# Altium schematic sheet STM32G4.SchDoc
size B; SheetNumber: 2; SheetTotal: 4
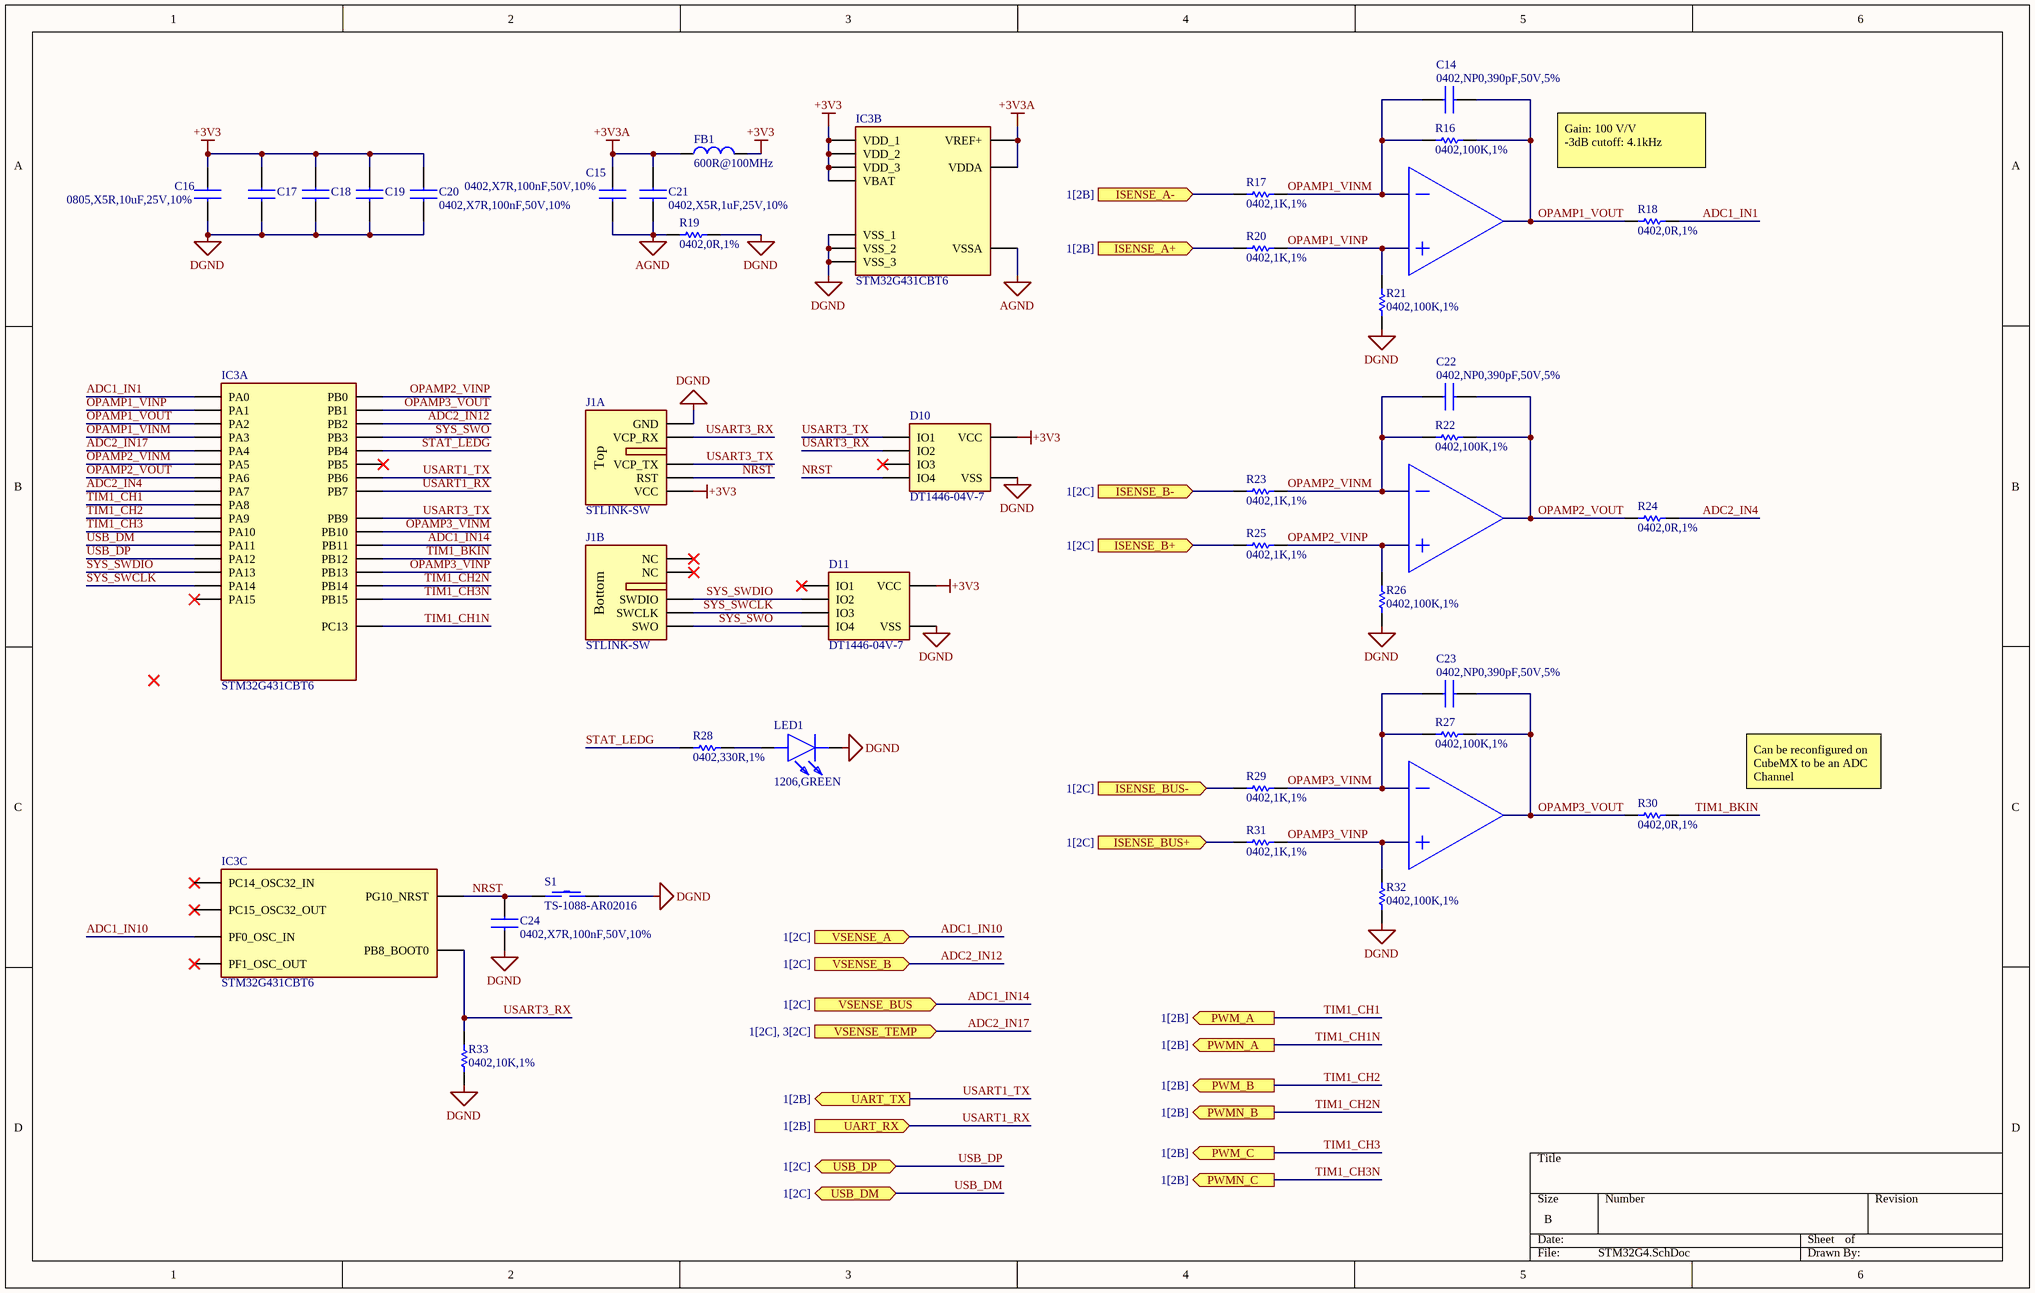
[diagram p0: STM32G4.SchDoc]

## Parts
C14  0402,NP0,390pF,50V,5%  [CAPC1005X55N]
C15  0402,X7R,100nF,50V,10%  [CAPC1005X55N]
C16  0805,X5R,10uF,25V,10%  [CAPC2012X145N]
C17  0402,X7R,100nF,50V,10%  [CAPC1005X55N]  (value not drawn)
C18  0402,X7R,100nF,50V,10%  [CAPC1005X55N]  (value not drawn)
C19  0402,X7R,100nF,50V,10%  [CAPC1005X55N]  (value not drawn)
C20  0402,X7R,100nF,50V,10%  [CAPC1005X55N]
C21  0402,X5R,1uF,25V,10%  [CAPC1005X55N]
C22  0402,NP0,390pF,50V,5%  [CAPC1005X55N]
C23  0402,NP0,390pF,50V,5%  [CAPC1005X55N]
C24  0402,X7R,100nF,50V,10%  [CAPC1005X55N]
D10  DT1446-04V-7  [SOTFL50P162X60-6N]
D11  DT1446-04V-7  [SOTFL50P162X60-6N]
FB1  600R@100MHz  [L0603]
IC3  STM32G431CBT6  [QFP50P900X900X160-48N]  (parts A,B,C of 3)
J1  STLINK-SW  [009159010061911]  (parts A,B of 2)  (no BOM)
LED1  1206,GREEN  [LEDC3216X120N]
R16  0402,100K,1%  [RESC1005X40N]
R17  0402,1K,1%  [RESC1005X40N]
R18  0402,0R,1%  [RESC1005X40N]
R19  0402,0R,1%  [RESC1005X40N]
R20  0402,1K,1%  [RESC1005X40N]
R21  0402,100K,1%  [RESC1005X40N]
R22  0402,100K,1%  [RESC1005X40N]
R23  0402,1K,1%  [RESC1005X40N]
R24  0402,0R,1%  [RESC1005X40N]
R25  0402,1K,1%  [RESC1005X40N]
R26  0402,100K,1%  [RESC1005X40N]
R27  0402,100K,1%  [RESC1005X40N]
R28  0402,330R,1%  [RESC1005X40N]
R29  0402,1K,1%  [RESC1005X40N]
R30  0402,0R,1%  [RESC1005X40N]
R31  0402,1K,1%  [RESC1005X40N]
R32  0402,100K,1%  [RESC1005X40N]
R33  0402,10K,1%  [RESC1005X40N]
S1  TS-1088-AR02016  [SW-SMD_L3.9-W3.0-P4.45]

## Ports
ISENSE_A+ (in, see 1[2B]), ISENSE_A- (in, see 1[2B]), ISENSE_B+ (in, see 1[2C]), ISENSE_B- (in, see 1[2C]), ISENSE_BUS+ (in, see 1[2C]), ISENSE_BUS- (in, see 1[2C]), PWM_A (out, see 1[2B]), PWM_B (out, see 1[2B]), PWM_C (out, see 1[2B]), PWMN_A (out, see 1[2B]), PWMN_B (out, see 1[2B]), PWMN_C (out, see 1[2B]), UART_RX (in, see 1[2B]), UART_TX (out, see 1[2B]), USB_DM (bidir, see 1[2C]), USB_DP (bidir, see 1[2C]), VSENSE_A (in, see 1[2C]), VSENSE_B (in, see 1[2C]), VSENSE_BUS (in, see 1[2C]), VSENSE_TEMP (in, see 1[2C], 3[2C])

## Nets
+3V3: C16.2 C17.2 C18.2 C19.2 C20.2 D10.5(VCC) D11.5(VCC) FB1.2 IC3.1(VBAT) IC3.24(VDD_1) IC3.36(VDD_2) IC3.48(VDD_3) J1.5(VCC)
+3V3A: C15.2 C21.2 FB1.1 IC3.20(VREF+) IC3.21(VDDA)
AGND: C15.1 C21.1 IC3.19(VSSA) R19.1
DGND: C16.1 C17.1 C18.1 C19.1 C20.1 C24.1 D10.2(VSS) D11.2(VSS) IC3.23(VSS_1) IC3.35(VSS_2) IC3.47(VSS_3) J1.1(GND) LED1.1(K) R19.2 R21.1 R26.1 R32.1 R33.1 S1.1
ADC1_IN1: IC3.8(PA0) R18.2
ADC1_IN10: IC3.5(PF0_OSC_IN) ; port VSENSE_A
ADC1_IN14: IC3.25(PB11) ; port VSENSE_BUS
ADC2_IN4: IC3.15(PA7) R24.2
ADC2_IN12: IC3.18(PB2) ; port VSENSE_B
ADC2_IN17: IC3.12(PA4) ; port VSENSE_TEMP
ISENSE_A+: R20.1 ; port ISENSE_A+
ISENSE_A-: R17.1 ; port ISENSE_A-
ISENSE_B+: R25.1 ; port ISENSE_B+
ISENSE_B-: R23.1 ; port ISENSE_B-
ISENSE_BUS+: R31.1 ; port ISENSE_BUS+
ISENSE_BUS-: R29.1 ; port ISENSE_BUS-
NRST: C24.2 D10.6(IO4) IC3.7(PG10_NRST) J1.4(RST) S1.2
OPAMP1_VINM: C14.1 IC3.11(PA3) R16.2 R17.2
OPAMP1_VINP: IC3.9(PA1) R20.2 R21.2
OPAMP1_VOUT: C14.2 IC3.10(PA2) R16.1 R18.1
OPAMP2_VINM: C22.1 IC3.13(PA5) R22.2 R23.2
OPAMP2_VINP: IC3.16(PB0) R25.2 R26.2
OPAMP2_VOUT: C22.2 IC3.14(PA6) R22.1 R24.1
OPAMP3_VINM: C23.1 IC3.22(PB10) R27.1 R29.2
OPAMP3_VINP: IC3.27(PB13) R31.2 R32.2
OPAMP3_VOUT: C23.2 IC3.17(PB1) R27.2 R30.1
STAT_LEDG: IC3.41(PB4) R28.1
SYS_SWCLK: D11.4(IO3) IC3.38(PA14) J1.9(SWCLK)
SYS_SWDIO: D11.3(IO2) IC3.37(PA13) J1.8(SWDIO)
SYS_SWO: D11.6(IO4) IC3.40(PB3) J1.10(SWO)
TIM1_BKIN: IC3.26(PB12) R30.2
TIM1_CH1: IC3.30(PA8) ; port PWM_A
TIM1_CH1N: IC3.2(PC13) ; port PWMN_A
TIM1_CH2: IC3.31(PA9) ; port PWM_B
TIM1_CH2N: IC3.28(PB14) ; port PWMN_B
TIM1_CH3: IC3.32(PA10) ; port PWM_C
TIM1_CH3N: IC3.29(PB15) ; port PWMN_C
USART1_RX: IC3.44(PB7) ; port UART_RX
USART1_TX: IC3.43(PB6) ; port UART_TX
USART3_RX: D10.3(IO2) IC3.45(PB8_BOOT0) J1.2(VCP_RX) R33.2
USART3_TX: D10.1(IO1) IC3.46(PB9) J1.3(VCP_TX)
USB_DM: IC3.33(PA11) ; port USB_DM
USB_DP: IC3.34(PA12) ; port USB_DP
NetLED1_2: LED1.2(A) R28.2

Not connected (* = marked no-connect by the designer): D10 4(IO3)*; D11 1(IO1)*; IC3 3(PC14_OSC32_IN)* 4(PC15_OSC32_OUT)* 6(PF1_OSC_OUT)* 39(PA15)* 42(PB5)*; J1 6(NC)* 7(NC)*

## Notes on the sheet
- Gain: 100 V/V
  -3dB cutoff: 4.1kHz
- Can be reconfigured on CubeMX to be an ADC Channel
- (in symbol STLINK-SW, part A) Top
- (in symbol STLINK-SW, part B) Bottom

## Library data of the parts
C14 C22 C23 = CC0402JRNPO9BN391: 390 pF ±5% 50V Ceramic Capacitor C0G, NP0 0402 (1005 Metric); Manufacturer_Name: YAGEO; Manufacturer_Part_Number: CC0402KRX7R9BB104; Datasheet Link: https://4donline.ihs.com/images/VipMasterIC/IC/YAGO/YAGO-S-A0003557223/YAGO-S-A0003557223-1.pdf?hkey=6D3A4C79FDBF58556ACFDE234799DDF0; Height: 0.55mm; Mouser Part Number: 603-CC402KRX7R9BB104; Mouser Price/Stock: https://www.mouser.co.uk/ProductDetail/YAGEO/CC0402KRX7R9BB104?qs=vRUrOTOuwyGrQb4GbTIVjw%3D%3D; Arrow Part Number: CC0402KRX7R9BB104; Arrow Price/Stock: https://www.arrow.com/en/products/cc0402krx7r9bb104/yageo?utm_currency=USD&region=europe; Manu Part #: CC0402JRNPO9BN391; LCSC Part #: C282239
C15 C17-C20 C24 = CC0402KRX7R9BB104: 0.1 µF ±10% 50V Ceramic Capacitor X7R 0402 (1005 Metric); Manufacturer_Name: YAGEO; Datasheet Link: https://4donline.ihs.com/images/VipMasterIC/IC/YAGO/YAGO-S-A0003557223/YAGO-S-A0003557223-1.pdf?hkey=6D3A4C79FDBF58556ACFDE234799DDF0; Height: 0.55mm; Manufacturer_Part_Number: CC0402KRX7R9BB104; Mouser Part Number: 603-CC402KRX7R9BB104; Mouser Price/Stock: https://www.mouser.co.uk/ProductDetail/YAGEO/CC0402KRX7R9BB104?qs=vRUrOTOuwyGrQb4GbTIVjw%3D%3D; Arrow Part Number: CC0402KRX7R9BB104; Arrow Price/Stock: https://www.arrow.com/en/products/cc0402krx7r9bb104/yageo?utm_currency=USD&region=europe; Manu Part #: CC0402KRX7R9BB104; LCSC Part #: C131394
C16 = CC0805KKX5R8BB106: 10 µF ±10% 25V Ceramic Capacitor X5R 0805 (2012 Metric); Manufacturer_Name: YAGEO; Datasheet Link: https://www.yageo.com/upload/media/product/productsearch/datasheet/mlcc/UPY-GPHC_X5R_4V-to-50V_27.pdf; Height: 1.45mm; Manufacturer_Part_Number: CC0805KKX5R8BB106; Mouser Part Number: 603-CC805KKX5R8BB106; Mouser Price/Stock: https://www.mouser.co.uk/ProductDetail/YAGEO/CC0805KKX5R8BB106?qs=57cj7OiSijm89pM64t1AGQ%3D%3D; Arrow Part Number: CC0805KKX5R8BB106; Arrow Price/Stock: https://www.arrow.com/en/products/cc0805kkx5r8bb106/yageo?utm_currency=USD&region=nac; LCSC Part #: C89831
C21 = CC0402KRX5R8BB105: 1 µF ±10% 25V Ceramic Capacitor X5R 0402 (1005 Metric); Manufacturer_Name: YAGEO; Manufacturer_Part_Number: CC0402KRX7R9BB104; Datasheet Link: https://4donline.ihs.com/images/VipMasterIC/IC/YAGO/YAGO-S-A0003557223/YAGO-S-A0003557223-1.pdf?hkey=6D3A4C79FDBF58556ACFDE234799DDF0; Height: 0.55mm; Mouser Part Number: 603-CC402KRX7R9BB104; Mouser Price/Stock: https://www.mouser.co.uk/ProductDetail/YAGEO/CC0402KRX7R9BB104?qs=vRUrOTOuwyGrQb4GbTIVjw%3D%3D; Arrow Part Number: CC0402KRX7R9BB104; Arrow Price/Stock: https://www.arrow.com/en/products/cc0402krx7r9bb104/yageo?utm_currency=USD&region=europe; Manu Part #: CC0402KRX5R8BB105; LCSC Part #: C326568
D10 D11 = DT1446-04V-7: 8.5V Clamp 4.7A (8/20µs) Ipp Tvs Diode Surface Mount SOT-563; Manufacturer_Name: Diodes Incorporated; Datasheet Link: https://www.diodes.com//assets/Datasheets/DT1446-04V.pdf; Height: 0.6mm; Manufacturer_Part_Number: DT1446-04V-7; Mouser Part Number: 621-DT1446-04V-7; Mouser Price/Stock: https://www.mouser.co.uk/ProductDetail/Diodes-Incorporated/DT1446-04V-7?qs=5V6w%252Be2aIqaQkUd2yRdmdA%3D%3D; Arrow Part Number: DT1446-04V-7; Arrow Price/Stock: https://www.arrow.com/en/products/dt1446-04v-7/diodes-incorporated; Manu Part #: DT1446-04V-7; LCSC Part #: C460066
FB1 = BLM18AG601SN1D: 380mΩ ±25% 600Ω@100MHz 0603 Ferrite Beads ROHS; LCSC Part #: C19330
IC3 = STM32G431CBT6: Arm Cortex-M4 32-bit MCU+FPU, 170 MHz / 213 DMIPS, up to 128 KB Flash, 32 KB SRAM, rich analog, math accelerator; Manufacturer_Name: STMicroelectronics; Datasheet Link: https://www.st.com/resource/en/datasheet/stm32g431cb.pdf; Height: 1.6mm; Manufacturer_Part_Number: STM32G431CBT6; Mouser Part Number: 511-STM32G431CBT6; Mouser Price/Stock: https://www.mouser.co.uk/ProductDetail/STMicroelectronics/STM32G431CBT6?qs=T3oQrply3y8OocyGDXq5wg%3D%3D; Arrow Part Number: STM32G431CBT6; Arrow Price/Stock: https://www.arrow.com/en/products/stm32g431cbt6/stmicroelectronics?utm_currency=USD&region=nac; LCSC Part #: C529355
J1 = STLINK-SW: SSL Connector 10 Position Adapter, Bridge Board to Board - Card Edge 0.079" (2.00mm)
LED1 = LTST-C150KGKT: 20mA 44.5mcd Water Clear -55℃~+85℃ 571nm Yellow Green 130° 75mW 2V 1206 LED Indication - Discrete ROHS; Manufacturer_Name: Lite-On; Datasheet Link: http://optoelectronics.liteon.com/upload/download/ds22-2000-072/ltst-c150kgkt.pdf; Height: 1.2mm; Manufacturer_Part_Number: LTST-C150KGKT; Mouser Part Number: 859-LTST-C150KGKT; Mouser Price/Stock: https://www.mouser.co.uk/ProductDetail/Lite-On/LTST-C150KGKT?qs=G7lFeYdtIHB%2FzaFKBwEyXw%3D%3D; Arrow Part Number: LTST-C150KGKT; Arrow Price/Stock: https://www.arrow.com/en/products/ltst-c150kgkt/lite-on-technology?utm_currency=USD&region=nac; LCSC Part #: C125085; Manu Part #: LTST-C150KGKT
R16 R21 R22 R26 R27 R32 = RC0402FR-07100KL: 100 kOhms ±1% 0.063W, 1/16W Chip Resistor 0402 (1005 Metric) Moisture Resistant Thick Film; Manufacturer_Name: YAGEO; Manufacturer_Part_Number: RC0402FR-0710KL; Datasheet Link: https://componentsearchengine.com/Datasheets/2/RC0402FR-0710KL.pdf; Height: 0.4mm; Mouser Part Number: 603-RC0402FR-0710KL; Mouser Price/Stock: https://www.mouser.co.uk/ProductDetail/YAGEO/RC0402FR-0710KL?qs=I1mnnYJTTsxUoNwrUsQExA%3D%3D; Arrow Part Number: RC0402FR-0710KL; Arrow Price/Stock: https://www.arrow.com/en/products/rc0402fr-0710kl/yageo?region=europe; Manu Part #: RC0402FR-07100KL; LCSC Part #: C60491
R17 R20 R23 R25 R29 R31 = RC0402FR-071KL: 1 kOhms ±1% 0.063W, 1/16W Chip Resistor 0402 (1005 Metric) Moisture Resistant Thick Film; Manufacturer_Name: YAGEO; Manufacturer_Part_Number: RC0402FR-0710KL; Datasheet Link: https://componentsearchengine.com/Datasheets/2/RC0402FR-0710KL.pdf; Height: 0.4mm; Mouser Part Number: 603-RC0402FR-0710KL; Mouser Price/Stock: https://www.mouser.co.uk/ProductDetail/YAGEO/RC0402FR-0710KL?qs=I1mnnYJTTsxUoNwrUsQExA%3D%3D; Arrow Part Number: RC0402FR-0710KL; Arrow Price/Stock: https://www.arrow.com/en/products/rc0402fr-0710kl/yageo?region=europe; Manu Part #: RC0402FR-071KL; LCSC Part #: C106235
R18 R19 R24 R30 = RC0402FR-070RL: 0 Ohms Jumper Chip Resistor 0402 (1005 Metric) Moisture Resistant Thick Film; Manufacturer_Name: YAGEO; Manufacturer_Part_Number: RC0402FR-0710KL; Datasheet Link: https://componentsearchengine.com/Datasheets/2/RC0402FR-0710KL.pdf; Height: 0.4mm; Mouser Part Number: 603-RC0402FR-0710KL; Mouser Price/Stock: https://www.mouser.co.uk/ProductDetail/YAGEO/RC0402FR-0710KL?qs=I1mnnYJTTsxUoNwrUsQExA%3D%3D; Arrow Part Number: RC0402FR-0710KL; Arrow Price/Stock: https://www.arrow.com/en/products/rc0402fr-0710kl/yageo?region=europe; Manu Part #: RC0402FR-070RL; LCSC Part #: C106231
R28 = RC0402FR-07330RL: 330 Ohms ±1% 0.063W, 1/16W Chip Resistor 0402 (1005 Metric) Moisture Resistant Thick Film; Manufacturer_Name: YAGEO; Manufacturer_Part_Number: RC0402FR-0710KL; Datasheet Link: https://componentsearchengine.com/Datasheets/2/RC0402FR-0710KL.pdf; Height: 0.4mm; Mouser Part Number: 603-RC0402FR-0710KL; Mouser Price/Stock: https://www.mouser.co.uk/ProductDetail/YAGEO/RC0402FR-0710KL?qs=I1mnnYJTTsxUoNwrUsQExA%3D%3D; Arrow Part Number: RC0402FR-0710KL; Arrow Price/Stock: https://www.arrow.com/en/products/rc0402fr-0710kl/yageo?region=europe; Manu Part #: RC0402FR-07330RL; LCSC Part #: C105875
R33 = RC0402FR-0710KL: 10 kOhms ±1% 0.063W, 1/16W Chip Resistor 0402 (1005 Metric) Moisture Resistant Thick Film; Manufacturer_Name: YAGEO; Datasheet Link: https://componentsearchengine.com/Datasheets/2/RC0402FR-0710KL.pdf; Height: 0.4mm; Manufacturer_Part_Number: RC0402FR-0710KL; Mouser Part Number: 603-RC0402FR-0710KL; Mouser Price/Stock: https://www.mouser.co.uk/ProductDetail/YAGEO/RC0402FR-0710KL?qs=I1mnnYJTTsxUoNwrUsQExA%3D%3D; Arrow Part Number: RC0402FR-0710KL; Arrow Price/Stock: https://www.arrow.com/en/products/rc0402fr-0710kl/yageo?region=europe
S1 = TS-1088-AR02016: Without Bracket 50mA 4mm 100,000 Cycles 12V 1.6N 3mm 2mm Round Button Surface Mount,Vertical SPST SMD Tactile Switches ROHS; LCSC Part #: C720477; Manu Part #: TS-1088-AR02016